# EAGLE design Trofodotiko (EAGLE 9.1.3)
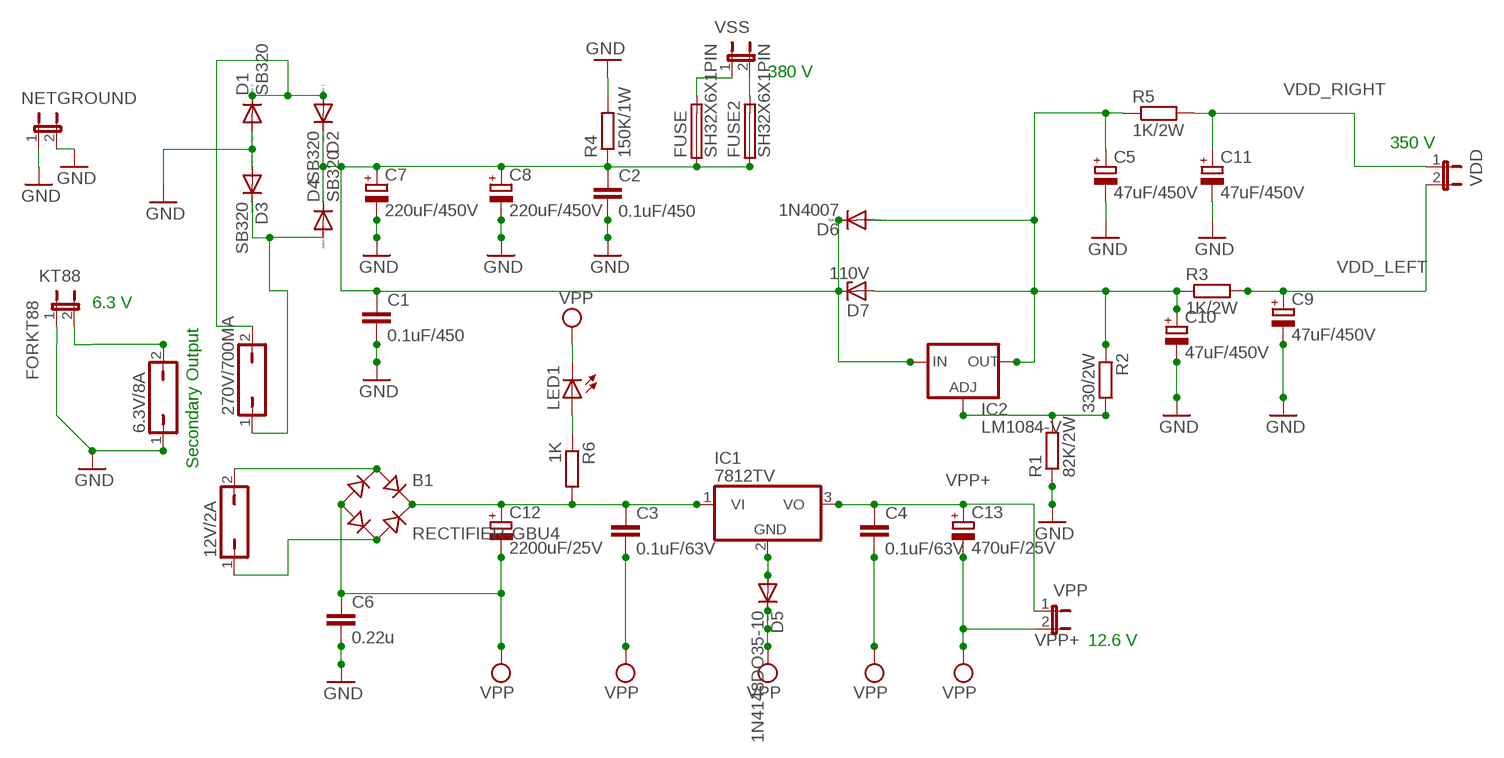
[diagram p0: schematic, sheet 1]

## Parts
6.3V/8A  JP1Q  [JP1]
12V/2A  JP1Q  [JP1]
270V/700MA  JP1Q  [JP1]
B1  RECTIFIER-GBU4  [GBU4]
C1  0.1uF/450  C10/5  [C10B5]
C2  0.1uF/450  C10/5  [C10B5]
C3  0.1uF/63V  C5/2.5  [C5B2.5]
C4  0.1uF/63V  C5/2.5  [C5B2.5]
C5  47uF/450V  CPOL-EUE5-13  [E5-13]
C6  0.22u  C-EUC0805K  [C0805K]
C7  220uF/450V  CPOL-EUE10-25  [EB25D]
C8  220uF/450V  CPOL-EUE10-25  [EB25D]
C9  47uF/450V  CPOL-EUE5-13  [E5-13]
C10  47uF/450V  CPOL-EUE5-13  [E5-13]
C11  47uF/450V  CPOL-EUE5-13  [E5-13]
C12  2200uF/25V  CPOL-EUE5-13  [E5-13]
C13  470uF/25V  CPOL-EUE3.5-8  [E3,5-8]
D1  SB320  [DO201-15]
D2  SB320  [DO201-15]
D3  SB320  [DO201-15]
D4  SB320  [DO201-15]
D5  1N4148DO35-10  [DO35-10]
D6  1N4007  1N5060GP  [DO15-12]
D7  110V  1N5333  [C1702-15]
FUSE  SH32X6X1PIN  [SH32]
FUSE2  SH32X6X1PIN  [SH32]
IC1  7812TV  [TO220V]
IC2  LM1084-V  [317TS]
KT88  JP1E  [JP1]
LED1  LEDSML0805  [SML0805]
NETGROUND  JP1E  [JP1]
R1  82K/2W  R-EU_0817/22  [P0817/22]
R2  330/2W  R-EU_0411/12  [0411/12]
R3  1K/2W  R-EU_0411/12  [0411/12]
R4  150K/1W  R-EU_0411/15  [0411/15]
R5  1K/2W  R-EU_0411/12  [0411/12]
R6  1K  R-EU_R0805  [R0805]
VDD  JP1E  [JP1]
VPP  JP1E  [JP1]
VSS  JP1E  [JP1]

## Nets
FORKT88: 6.3V/8A.2 KT88.2
GND: 6.3V/8A.1 C1.2 C2.2 C5.- C6.2 C7.- C8.- C9.- C10.- C11.- D1.A D3.A KT88.1 NETGROUND.1 NETGROUND.2 R1.1 R4.2
N$1: 270V/700MA.2 D1.C D2.A
N$2: LED1.A R6.1
N$3: C1.1 C2.1 C7.+ C8.+ D2.C D4.C D6.C D7.C FUSE2.1A FUSE.1A IC2.3(IN) R4.1
N$4: 270V/700MA.1 D3.C D4.A
N$5: 12V/2A.2 B1.AC1
N$6: 12V/2A.1 B1.AC2
N$7: B1.+ C3.1 C12.+ IC1.1(VI) R6.2
N$9: C5.+ C10.+ D6.A D7.A IC2.2(OUT) R2.1 R3.1 R5.1
N$10: FUSE.2B VSS.1
N$11: FUSE2.2B VSS.2
N$12: IC2.1(ADJ) R1.2 R2.2
N$13: D5.A IC1.2(GND)
VDD_LEFT: C9.+ R3.2 VDD.2
VDD_RIGHT: C11.+ R5.2 VDD.1
VPP: B1.- C3.2 C4.2 C6.1 C12.- C13.- D5.C LED1.C VPP.2
VPP+: C4.1 C13.+ IC1.3(VO) VPP.1

## Notes on the sheet
- 380 V
- 350 V
- 6.3 V
- Secondary Output
- 12.6 V

## Library data of the parts
6.3V/8A 12V/2A 270V/700MA = jumper:JP1Q: JUMPER
B1 = rectifier:RECTIFIER-: Rectifier
C1-C4 = capacitor-wima:C: CAPACITOR naming: grid - package width
C5 C7-C13 = rcl:CPOL-EU: POLARIZED CAPACITOR, European symbol; SPICEPREFIX: C
C6 = rcl:C-EU: CAPACITOR, European symbol; SPICEPREFIX: C
D1-D4 = diode:SB320: DIODE barrier rectifier, 3 A (Fairchild)
D5 = diode:1N4148: DIODE high speed (Philips)
D6 = diode:1N5060GP: DIODE controlled avalanche rectifier
D7 = diode:1N5333: Z DIODE 3.3 V, 5W, 5 percent (Motorola)
FUSE FUSE2 = fuse:SH32X6X1PIN
IC1 = linear:78*: Positive VOLTAGE REGULATOR Source: http://cache.national.com/ds/LM/LM78L05.pdf http://www.fairchildsemi.com/ds/LM/LM7805.pdf
IC2 = v-reg:LM1084: VOLTAGE REGULATOR
KT88 NETGROUND VDD VPP VSS = jumper:JP1E: JUMPER
LED1 = led:LED: LED OSRAM: - CHIPLED LG R971, LG N971, LY N971, LG Q971, LY Q971, LO R971, LY R971 LH N974, LH R974 LS Q976, LO Q976, LY Q976 LO Q996 - Hyper CHIPLED LW Q18S LB Q993, LB Q99A, LB R99A - SideLED LS A670, LO A670, LY A670, LG A670, LP A670 LB A673, LV A673, LT A673, LW A673 LH A674 LY A675 LS A676, LA A676, LO A676, LY A676, LW A676 LS A679, LY A679, LG A679 - Hyper Micro SIDELED® LS Y876, LA Y876, LO Y876, LY Y876 LT Y87S - SmartLED LW L88C, LW L88S LB L89C, LB L89S, LG L890 LS L89K, LO L89K, LY L89K LS L896, LA L896, LO L896, LY L896 - TOPLED LS T670, LO T670, LY T670, LG T670, LP T670 LSG T670, LSP T670, LSY T670, LOP T670, LYG T670 LG T671, LOG T671, LSG T671 LB T673, LV T673, LT T673, LW T673 LH T674 LS T676, LA T676, LO T676, LY T676, LB T676, LH T676, LSB T676, LW T676 LB T67C, LV T67C, LT T67C, LS T67K, LO T67K, LY T67K, LW E67C LS E67B, LA E67B, LO E67B, LY E67B, LB E67C, LV E67C, LT E67C LW T67C LS T679, LY T679, LG T679 LS T770, LO T770, LY T770, LG T770, LP T770 LB T773, LV T773, LT T773, LW T773 LH T774 LS E675, LA E675, LY E675, LS T675 LS T776, LA T776, LO T776, LY T776, LB T776 LHGB T686 LT T68C, LB T68C - Hyper Mini TOPLED® LB M676 - Mini TOPLED Santana® LG M470 LS M47K, LO M47K, LY M47K Source: http://www.osram.convergy.de LUXEON: - LUMILED® LXK2-PW12-R00, LXK2-PW12-S00, LXK2-PW14-U00, LXK2-PW14-V00 LXK2-PM12-R00, LXK2-PM12-S00, LXK2-PM14-U00 LXK2-PE12-Q00, LXK2-PE12-R00, LXK2-PE12-S00, LXK2-PE14-T00, LXK2-PE14-U00 LXK2-PB12-K00, LXK2-PB12-L00, LXK2-PB12-M00, LXK2-PB14-N00, LXK2-PB14-P00, LXK2-PB14-Q00 LXK2-PR12-L00, LXK2-PR12-M00, LXK2-PR14-Q00, LXK2-PR14-R00 LXK2-PD12-Q00, LXK2-PD12-R00, LXK2-PD12-S00 LXK2-PH12-R00, LXK2-PH12-S00 LXK2-PL12-P00, LXK2-PL12-Q00, LXK2-PL12-R00 Source: www.luxeon.com KINGBRIGHT: KA-3528ASYC Source: www.kingbright.com
R1 R6 = rcl:R-EU_: RESISTOR, European symbol; SPICEPREFIX: R
R2-R5 = resistor:R-EU_: RESISTOR, European symbol

## Board
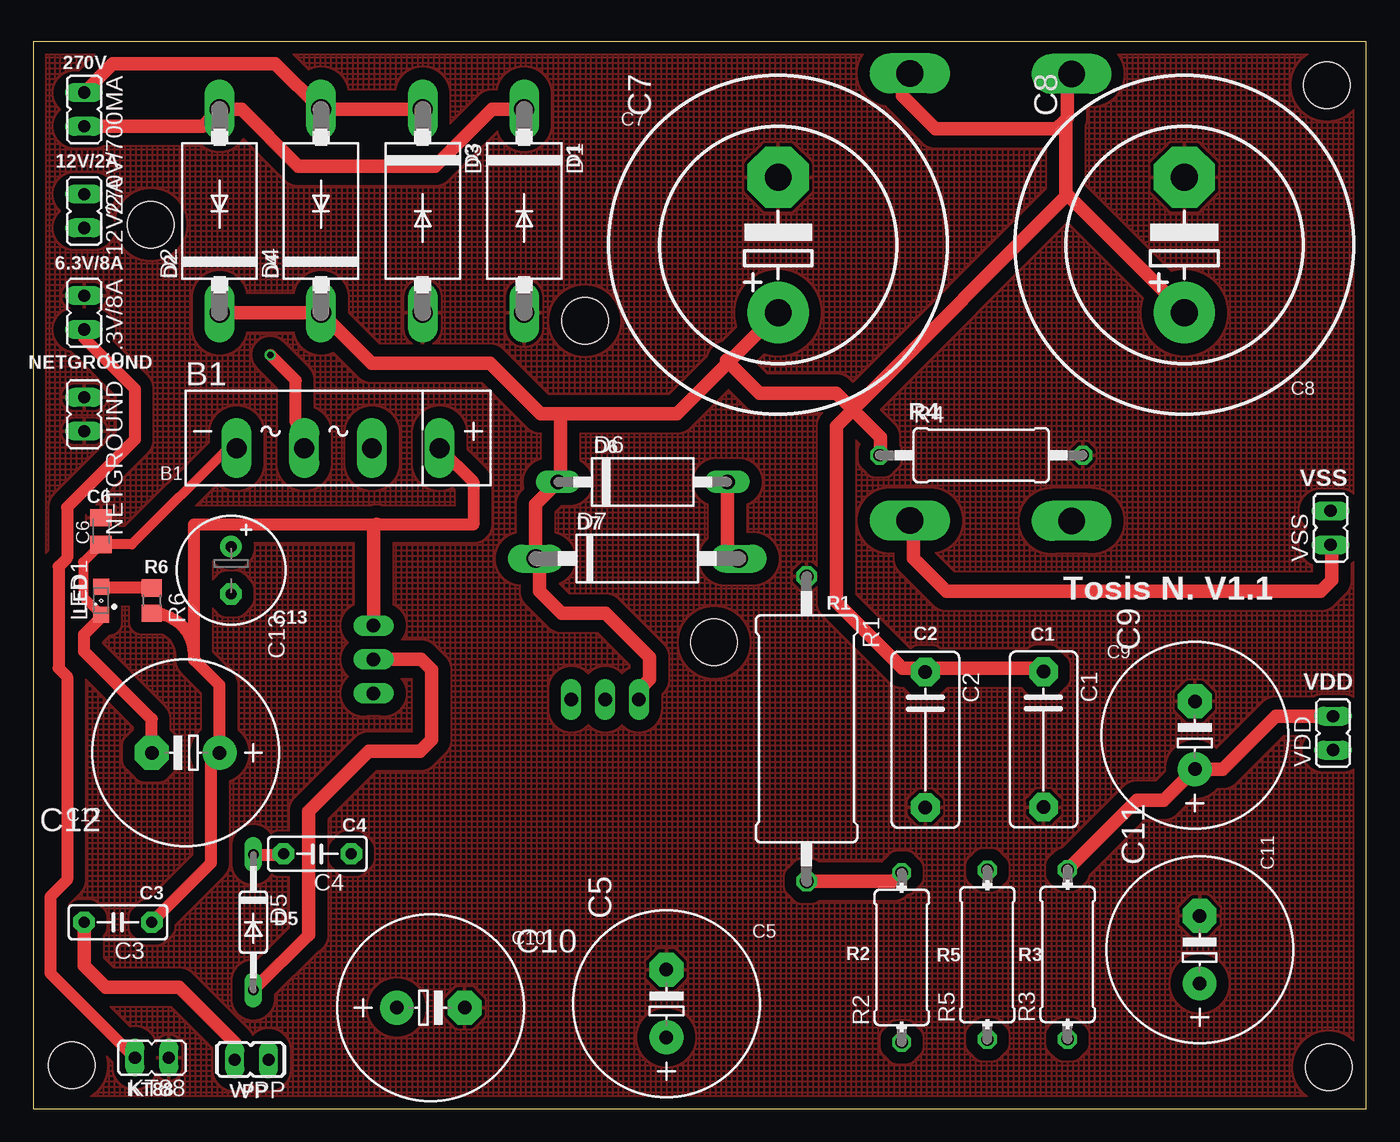
[diagram p1: board, top side]
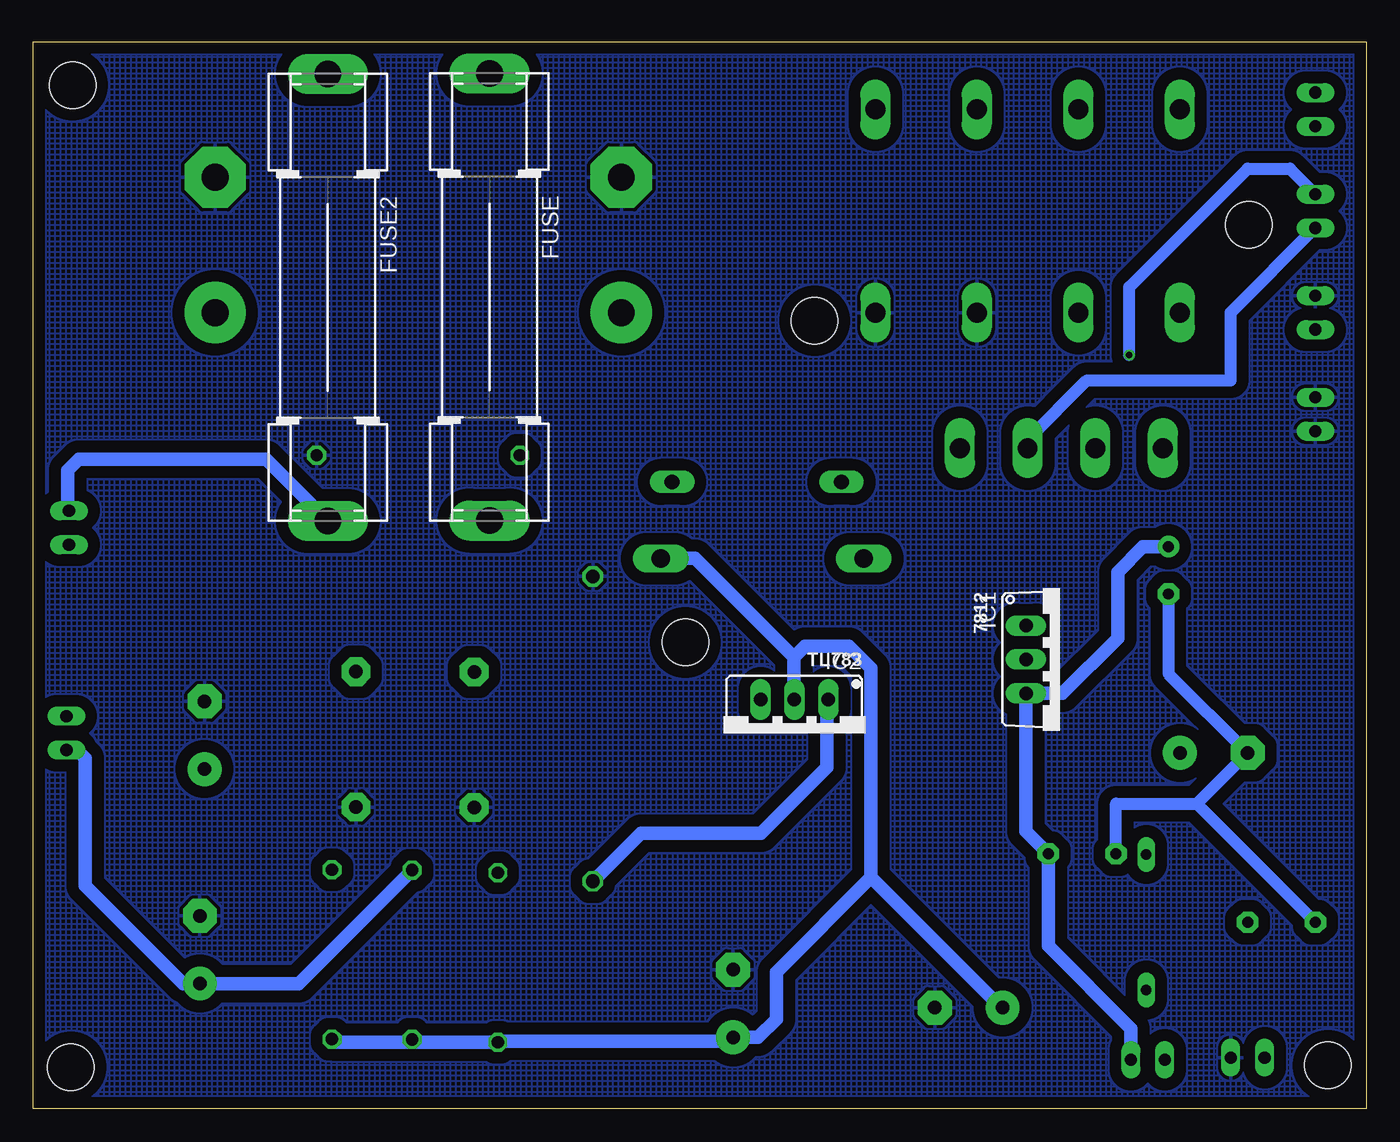
[diagram p2: board, bottom side, seen from below]

Size 100 x 80 mm. Coordinates in mm from the lower left corner, seen from the top.
Outline: 0,0 100,0 100,80 0,80 0,0
Copper layers (1*16): Top 0.035mm / dielectric 1.5mm / Bottom 0.035mm
Design rules "SeeedStudio_2layer_DRU_no_angle_20140221": minimum track width 6mil, minimum drill 12mil, track to track 6mil, track to pad 6mil, pad to pad 6mil, via to via 6mil, smd to smd 0mil, copper to edge 10mil, drill to drill 10mil, minimum pad ring 10mil, minimum via ring 6mil, stop-mask expansion 2mil, vias tented up to drill 100mil, thermal gap 10mil
Holes 3.5 mm at 2.87,3.23 97.18,3.1 97.05,76.76 8.81,66.29 41.38,59.08 51.08,34.95

### Footprints (pad centres in the part's own frame; a part is rotated, then mirrored left to right if it is on the bottom)
JP1 = drill 0.914 long: 1 0,-1.27; 2 0,1.27
GBU4 = drill 1.499 long: + 7.62,0; - -7.62,0; AC1 2.54,0; AC2 -2.54,0
C10B5 = drill 1.016 pad 2.159 octagon: 1 -5.08,0; 2 5.08,0
C5B2.5 = drill 0.813 pad 1.6 octagon: 1 -2.54,0; 2 2.54,0
E5-13 = drill 1.016 pad 2.54: + -2.54,0 | drill 1.016 pad 2.54 octagon: - 2.54,0
C0805K = smd 1.3 x 1.6: 1 -1,0; 2 1,0
EB25D = drill 2.007 pad 4.597: + -5.08,0 | drill 2.007 pad 4.597 octagon: - 5.08,0
E3,5-8 = drill 0.813 pad 1.6: + -1.778,0 | drill 0.813 pad 1.6 octagon: - 1.778,0
DO201-15 = drill 1.499 long: A 7.62,0; C -7.62,0
DO35-10 = drill 0.813 long: A 5.08,0; C -5.08,0
DO15-12 = drill 1.118 long: A 6.35,0; C -6.35,0
C1702-15 = drill 1.397 long: A 7.62,0; C -7.62,0
SH32 = drill 2.007 long: 1A -16.764,0; 2B 16.764,0
TO220V = drill 1.016 long: 1 -2.54,-2.54; 2 0,-2.54; 3 2.54,-2.54
317TS = drill 1.016 long: 1 -2.54,-2.54; 2 0,-2.54; 3 2.54,-2.54
SML0805 = smd 1.2 x 1.2: A 1.05,0; C -1.05,0
P0817/22 = drill 1.016 octagon: 1 -11.43,0; 2 11.43,0
0411/12 = drill 0.914 octagon: 1 -6.35,0; 2 6.35,0
0411/15 = drill 0.914 octagon: 1 -7.62,0; 2 7.62,0
R0805 = smd 1.3 x 1.5: 1 -0.95,0; 2 0.95,0

### Placement (x,y rotation side)
6.3V/8A  3.81,59.69 180 top
12V/2A  3.81,67.31 180 top
270V/700MA  3.81,74.93 180 top
B1  22.86,49.53 0 top
C1  75.79,27.69 270 top
C2  66.93,27.66 270 top
C3  6.35,13.97 180 top
C4  21.31,19.1 180 top
C5  47.5,7.87 90 top
C6  5.08,43.31 90 top
C7  55.88,64.77 90 top
C8  86.36,64.77 90 top
C9  87.15,27.99 90 top
C10  29.82,7.57 0 top
C11  87.5,11.91 90 top
C12  11.43,26.67 180 top
C13  14.83,40.36 270 top
D1  36.83,67.31 270 top
D2  13.97,67.31 90 top
D3  29.21,67.31 270 top
D4  21.59,67.31 90 top
D5  16.51,13.97 270 top
D6  45.72,46.99 0 top
D7  45.31,41.25 0 top
FUSE  65.77,60.86 270 bottom
FUSE2  77.91,60.83 270 bottom
IC1  22.99,33.68 270 bottom
IC2  42.9,28.14 180 bottom
KT88  8.89,3.81 90 top
LED1  5.08,38.1 90 top
NETGROUND  3.81,52.07 180 top
R1  58.01,28.47 270 top
R2  65.15,11.33 90 top
R3  77.6,11.56 90 top
R4  71.12,49 0 top
R5  71.58,11.53 90 top
R6  8.89,38.1 270 top
VDD  97.52,28.16 0 top
VPP  16.38,3.66 90 top
VSS  97.32,43.55 0 top

### Tracks (layer width: path | path; a pad name or v marks a point on that pad's centre or on a via)
FORKT88
  Top 0.889: KT88.2 1.27,10.16 1.27,15.88 2.54,17.14 2.54,32.38 1.91,33.02 1.91,40.64 2.54,41.27 2.54,45.09 7.62,50.16 7.62,53.98 3.81,57.78 6.3V/8A.2
GND
  pour Bottom (isolate 0.889, hatched): 0,0 100,0 100,79.98 99.42,79.98 0,79.98 0,78.31
  pour Top (isolate 0.889, rank 2, hatched): 0,0 100,0 100,79.96 0,79.96 0,79.4
N$1
  Top 1.016: D1.C 34.41,74.93 30.15,70.67 19.89,70.67 15.63,74.93 D2.A 12.7,73.66 270V/700MA.2
N$2
  Top 0.889: R6.1 5.18,39.05 arc-90 LED1.A
N$3
  Top 1.016: C7.+ 52.16,55.98 | 52.16,55.98 48.28,52.09 39.55,52.09 | 39.55,52.09 38.08,52.09 34.27,55.91 25.38,55.91 D4.C D2.C | 77.46,74.16 77.6,74.3 77.6,76.77 FUSE2.1A | FUSE.1A 65.22,77.6 65.22,75.95 67.69,73.47 76.77,73.47 77.46,74.16 | 77.6,68.52 77.46,68.66 77.46,74.16 | 77.6,68.52 85.85,60.26 C8.+ | IC2.3 45.4,31.37 46.23,32.19 46.23,33.85 42.93,37.15 39.62,37.15 37.97,38.8 37.97,40.45 D7.C 37.69,45.31 D6.C 39.55,47.17 39.55,52.09 | 61.09,52.83 60.26,53.66 54.48,53.66 52.16,55.98 | 61.51,52.41 61.91,52.01 63.56,50.35 63.56,49.53 R4.1 | 52.16,55.98 52.01,56.13 52.16,55.98 | 66.86,33.02 65.22,33.02 60.26,37.97 60.26,51.17 61.51,52.41 | 66.86,33.02 C2.1 | 77.6,68.52 61.91,52.83 61.09,52.83 | C1.1 75.54,33.02 66.86,33.02 | 61.09,52.83 61.51,52.41
N$4
  Top 1.016: 270V/700MA.1 5.97,78.36 18.16,78.36 D4.A D3.C
N$5
  Bottom 0.889: 12V/2A.2 10.16,59.69 10.16,54.61 20.95,54.61 25.4,50.16 B1.AC1
N$6  (via drill 0.51 pad 0.81)
  Top 0.889: v17.78,56.52 19.68,54.61 19.68,51.44 20.32,50.8 B1.AC2
  Bottom 0.889: 12V/2A.1 5.71,70.48 8.89,70.48 17.78,61.59 v17.78,56.52
N$7
  Top 0.889: B1.+ 33.02,46.99 33.02,43.81 29.72,43.81 25.76,43.81 12.06,43.81 12.06,33.66 | 12.06,33.66 13.97,31.75 C12.+ 13.34,26.04 13.34,18.41 C3.1 | 12.06,33.66 12.06,33.98 arc90 R6.2
  Top 1.016: IC1.1 25.53,43.59 25.76,43.81
N$9
  Top 1.016: D7.A 52.07,42.11 D6.A
  Bottom 1.016: 42.93,33.85 42.93,31.37 IC2.2 | D7.A 52.83,41.27 50.35,41.27 42.93,33.85 | 37.15,17.34 28.07,8.26 C10.+ | 37.15,17.34 37.15,33.02 38.8,34.67 42.1,34.67 42.93,33.85 | 37.15,17.34 44.25,10.24 44.25,6.71 45.62,5.33 C5.+ 47.8,5.03 65.1,5.03 R2.1 71.37,4.98 R5.1 71.81,4.95 77.34,4.95 R3.1
N$10
  Top 1.016: VSS.1 97.41,42.1 97.41,39.62 96.58,38.8 68.52,38.8 66.04,41.27 66.04,43.75 FUSE.2B
N$11
  Bottom 1.016: VSS.2 97.41,45.4 97.41,47.88 96.58,48.7 82.55,48.7 79.25,45.4 79.25,44.58 78.42,43.75 FUSE2.2B
N$12
  Top 1.016: R2.2 64.52,17.04 R1.2
  Bottom 1.016: IC2.1 40.45,30.54 40.45,29.72 40.45,25.59 45.4,20.64 54.42,20.64 R1.2
N$13
  Top 0.889: D5.A 20.64,13.02
  Top 1.016: 20.64,13.02 20.64,22.29 25.15,26.8 29.01,26.8 29.87,27.66 29.87,32.92 29.11,33.68 IC1.2 25.73,33.48
VDD_LEFT
  Top 1.016: R3.2 82.8,23.11 84.81,23.11 C9.+ 89.26,25.45 93.23,29.43 VDD.2
VDD_RIGHT
  Bottom 1.016: R5.2 80.09,9.37 C11.+ 88.77,9.37 96.11,16.71 96.11,26.26 96.74,26.89 VDD.1
VPP
  Top 0.152: 18.72,19.05 C4.2
  Top 0.762: LED1.C 3.74,38.39 3.74,40.97 C6.1 7.38,42.31 14.61,49.53
  Top 0.889: C12.- 8.89,29.21 3.81,34.29 3.81,35.56 5.08,36.83 LED1.C | B1.- 14.61,49.53 | D5.C 18.72,19.05
  Top 1.016: VPP.2 15.11,4.93 10.95,9.09 5.44,9.09 3.81,10.72 C3.2
  Bottom 0.889: 12.7,22.86 C12.- 14.83,32.61 C13.- | 12.7,22.86 C3.2 | C4.2 18.77,22.86 12.7,22.86
VPP+
  Bottom 1.016: VPP.1 17.65,5.99 23.85,12.19 C4.1 25.53,20.78 IC1.3 22.78,31.14 18.64,35.28 18.64,40.23 16.74,42.14 C13.+

### Text on the board
tsilk: 270V | C7 | 12V/2A | D3 | D1 | 6.3V/8A | D2 | D4 | NETGROUND | C8 | R4 | D6 | VSS | B1 | C6 | D7 | R6 | Tosis N. V1.1 | LED | R1 | C13 | C2 | C1 | C9 | VDD | C12 | C4 | C11 | C3 | D5 | C5 | C10 | R2 | R5 | R3 | KT88 | VPP
bsilk: 7812 | TL783